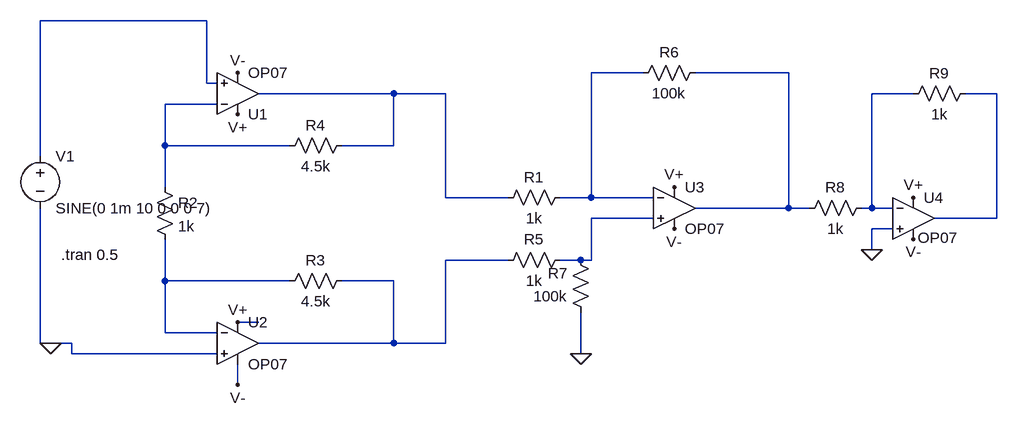
[diagram p0: schematic Instrumentation Amplifier.asc]
Instrumentation Amplifier.asc, the LTspice schematic file:
Version 4.1
SHEET 1 1044 680
WIRE -176 -80 -432 -80
WIRE 496 0 416 0
WIRE 720 0 576 0
WIRE -176 16 -176 -80
WIRE -160 16 -176 16
WIRE 112 32 -96 32
WIRE 192 32 112 32
WIRE 912 32 848 32
WIRE 1040 32 992 32
WIRE -160 48 -240 48
WIRE -240 112 -240 48
WIRE -48 112 -240 112
WIRE 112 112 112 32
WIRE 112 112 32 112
WIRE -432 128 -432 -80
WIRE -240 176 -240 112
WIRE 192 192 192 32
WIRE 288 192 192 192
WIRE 416 192 416 0
WIRE 416 192 368 192
WIRE 512 192 416 192
WIRE 720 208 720 0
WIRE 720 208 576 208
WIRE 752 208 720 208
WIRE 848 208 848 32
WIRE 848 208 832 208
WIRE 880 208 848 208
WIRE 512 224 416 224
WIRE 1040 224 1040 32
WIRE 1040 224 944 224
WIRE 880 240 848 240
WIRE 848 272 848 240
WIRE 288 288 192 288
WIRE 400 288 368 288
WIRE 416 288 416 224
WIRE 416 288 400 288
WIRE -240 320 -240 256
WIRE -48 320 -240 320
WIRE 112 320 32 320
WIRE -96 384 -128 384
WIRE -240 400 -240 320
WIRE -160 400 -240 400
WIRE -432 416 -432 208
WIRE -416 416 -432 416
WIRE -384 416 -416 416
WIRE 112 416 112 320
WIRE 112 416 -96 416
WIRE 192 416 192 288
WIRE 192 416 112 416
WIRE -384 432 -384 416
WIRE -160 432 -384 432
WIRE 400 432 400 368
WIRE -128 480 -128 448
FLAG 400 432 0
FLAG -128 64 V+
FLAG -128 384 V+
FLAG -128 480 V-
FLAG -128 0 V-
FLAG 544 240 V-
FLAG 544 176 V+
FLAG 848 272 0
FLAG 912 192 V+
FLAG 912 256 V-
FLAG -416 416 0
SYMBOL OpAmps\\OP07 -128 96 M180
SYMATTR InstName U1
SYMBOL OpAmps\\OP07 -128 352 R0
SYMATTR InstName U2
SYMBOL OpAmps\\OP07 544 144 R0
SYMATTR InstName U3
SYMBOL res 384 176 R90
WINDOW 0 0 56 VBottom 2
WINDOW 3 32 56 VTop 2
SYMATTR InstName R1
SYMATTR Value 1k
SYMBOL res -256 160 R0
SYMATTR InstName R2
SYMATTR Value 1k
SYMBOL res 48 304 R90
WINDOW 0 0 56 VBottom 2
WINDOW 3 32 56 VTop 2
SYMATTR InstName R3
SYMATTR Value 4.5k
SYMBOL res 48 96 R90
WINDOW 0 0 56 VBottom 2
WINDOW 3 32 56 VTop 2
SYMATTR InstName R4
SYMATTR Value 4.5k
SYMBOL res 384 272 R90
WINDOW 0 0 56 VBottom 2
WINDOW 3 32 56 VTop 2
SYMATTR InstName R5
SYMATTR Value 1k
SYMBOL res 592 -16 R90
WINDOW 0 0 56 VBottom 2
WINDOW 3 32 56 VTop 2
SYMATTR InstName R6
SYMATTR Value 100k
SYMBOL res 416 384 R180
WINDOW 0 36 76 Left 2
WINDOW 3 36 40 Left 2
SYMATTR InstName R7
SYMATTR Value 100k
SYMBOL OpAmps\\OP07 912 160 R0
WINDOW 3 7 94 Left 2
SYMATTR InstName U4
SYMBOL res 848 192 R90
WINDOW 0 0 56 VBottom 2
WINDOW 3 32 56 VTop 2
SYMATTR InstName R8
SYMATTR Value 1k
SYMBOL res 1008 16 R90
WINDOW 0 0 56 VBottom 2
WINDOW 3 32 56 VTop 2
SYMATTR InstName R9
SYMATTR Value 1k
SYMBOL voltage -432 112 R0
WINDOW 123 0 0 Left 0
WINDOW 39 0 0 Left 0
SYMATTR InstName V1
SYMATTR Value SINE(0 1m 10 0 0 0 7)
TEXT -400 280 Left 2 !.tran 0.5

The netlist it stands for:
* Instrumentation Amplifier.asc
X§U1 N001 N007 V+ V- N004 LT1001  ; OP07, pins In+ In- V+ V- OUT
X§U2 0 N010 V+ V- N009 LT1001  ; OP07, pins In+ In- V+ V- OUT
X§U3 N008 N002 V+ V- N003 LT1001  ; OP07, pins In+ In- V+ V- OUT
R1 N002 N004 1k
R2 N007 N010 1k
R3 N009 N010 4.5k
R4 N004 N007 4.5k
R5 N008 N009 1k
R6 N003 N002 100k
R7 0 N008 100k
X§U4 0 N005 V+ V- N006 LT1001  ; OP07, pins In+ In- V+ V- OUT
R8 N005 N003 1k
R9 N006 N005 1k
V1 N001 0 SINE(0 1m 10 0 0 0 7)
.tran 0.5
.lib LTC.lib
.backanno
.end